# EAGLE design LED_MatrixA (EAGLE 5.02)
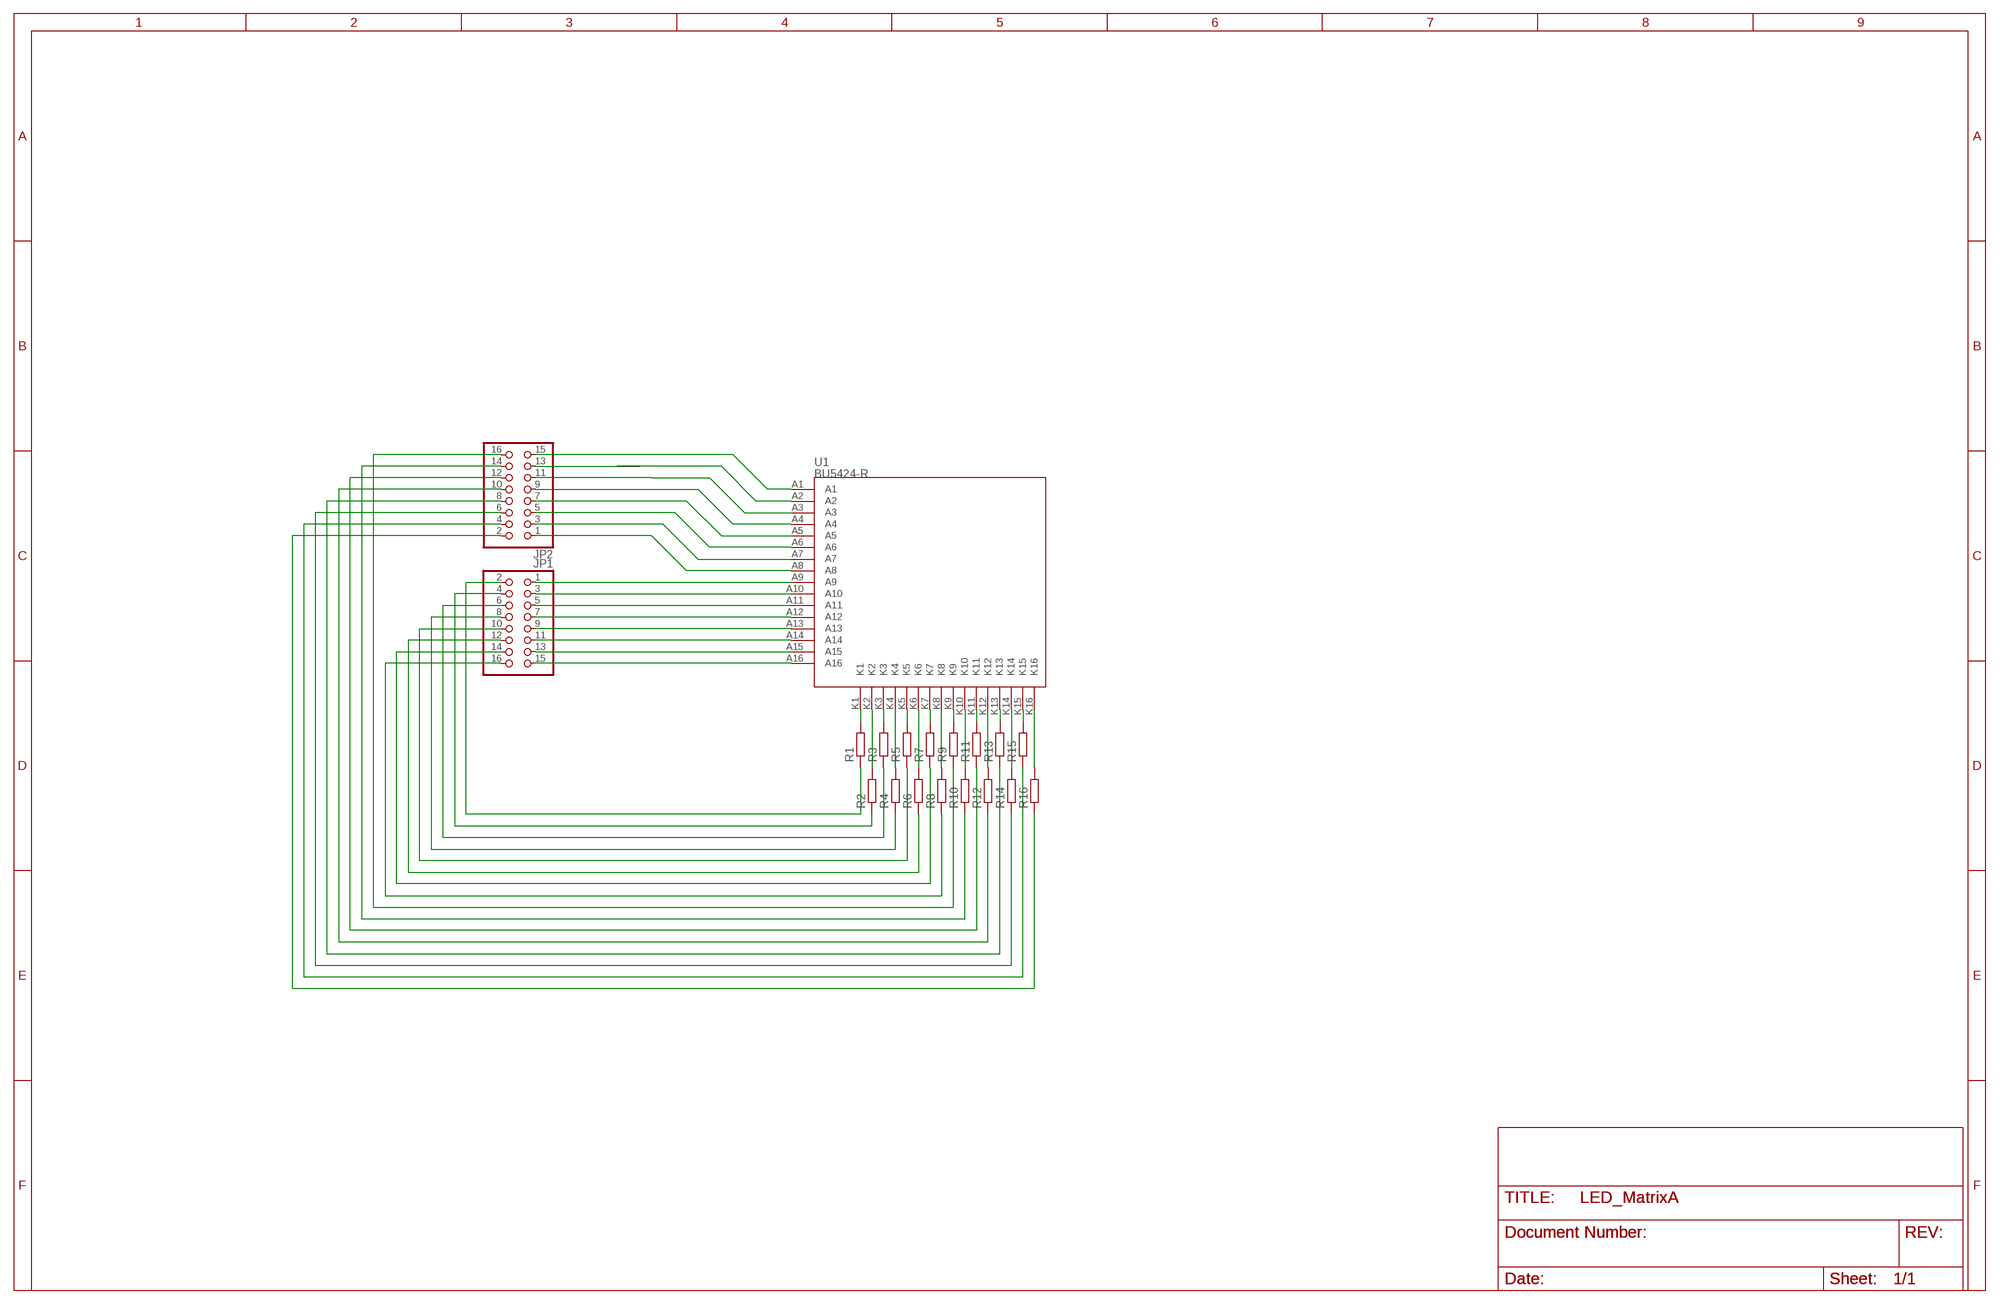
[diagram p0: schematic, sheet 1]

## Parts
JP1  PINHD-2X8  [2X08]
JP2  PINHD-2X8  [2X08]
R1  R-EU_R0805  [R0805]
R2  R-EU_R0805  [R0805]
R3  R-EU_R0805  [R0805]
R4  R-EU_R0805  [R0805]
R5  R-EU_R0805  [R0805]
R6  R-EU_R0805  [R0805]
R7  R-EU_R0805  [R0805]
R8  R-EU_R0805  [R0805]
R9  R-EU_R0805  [R0805]
R10  R-EU_R0805  [R0805]
R11  R-EU_R0805  [R0805]
R12  R-EU_R0805  [R0805]
R13  R-EU_R0805  [R0805]
R14  R-EU_R0805  [R0805]
R15  R-EU_R0805  [R0805]
R16  R-EU_R0805  [R0805]
U1  BU5424-R  [BU5424]

## Nets
N$1: JP1.4 R2.1
N$3: JP2.9 U1.A4
N$5: JP2.5 U1.A6
N$6: JP2.1 U1.A8
N$7: JP2.3 U1.A7
N$9: JP1.1 U1.A9
N$10: JP1.3 U1.A10
N$11: JP1.5 U1.A11
N$12: JP1.7 U1.A12
N$13: JP1.9 U1.A13
N$14: JP1.11 U1.A14
N$15: JP1.13 U1.A15
N$16: JP1.15 U1.A16
N$17: R1.2 U1.K1
N$18: R3.2 U1.K3
N$19: R5.2 U1.K5
N$20: R7.2 U1.K7
N$21: R9.2 U1.K9
N$22: R11.2 U1.K11
N$23: R13.2 U1.K13
N$24: R15.2 U1.K15
N$25: R16.2 U1.K16
N$26: R14.2 U1.K14
N$27: R12.2 U1.K12
N$28: R10.2 U1.K10
N$29: R8.2 U1.K8
N$30: R6.2 U1.K6
N$31: R4.2 U1.K4
N$32: R2.2 U1.K2
N$54: JP2.2 R16.1
N$55: JP2.4 R15.1
N$56: JP2.6 R14.1
N$57: JP2.8 R13.1
N$58: JP2.10 R12.1
N$59: JP2.12 R11.1
N$60: JP2.14 R10.1
N$61: JP2.16 R9.1
N$62: JP1.16 R8.1
N$63: JP2.7 U1.A5
N$64: JP1.14 R7.1
N$65: JP1.12 R6.1
N$66: JP1.10 R5.1
N$67: JP1.8 R4.1
N$68: JP1.6 R3.1
N$70: JP1.2 R1.1
N$72: JP2.11 U1.A3
N$73: JP2.13 U1.A2
N$74: JP2.15 U1.A1

## Library data of the parts
JP1 JP2 = pinhead:PINHD-2X8: PIN HEADER
R1-R16 = rcl:R-EU_: RESISTOR, European symbol
U1 = LEDMATRIX:BU5424-R

## Board
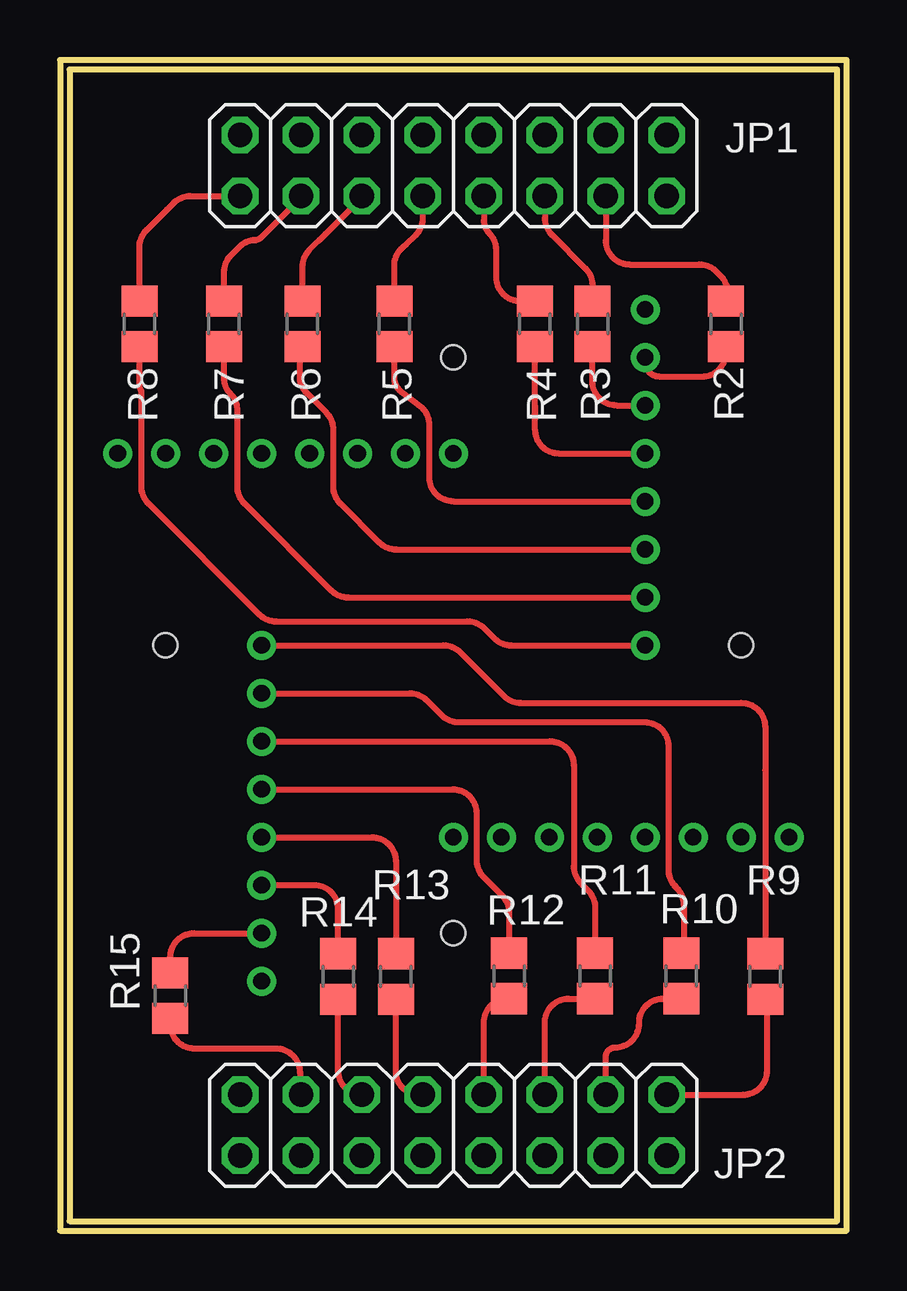
[diagram p1: board, top side]
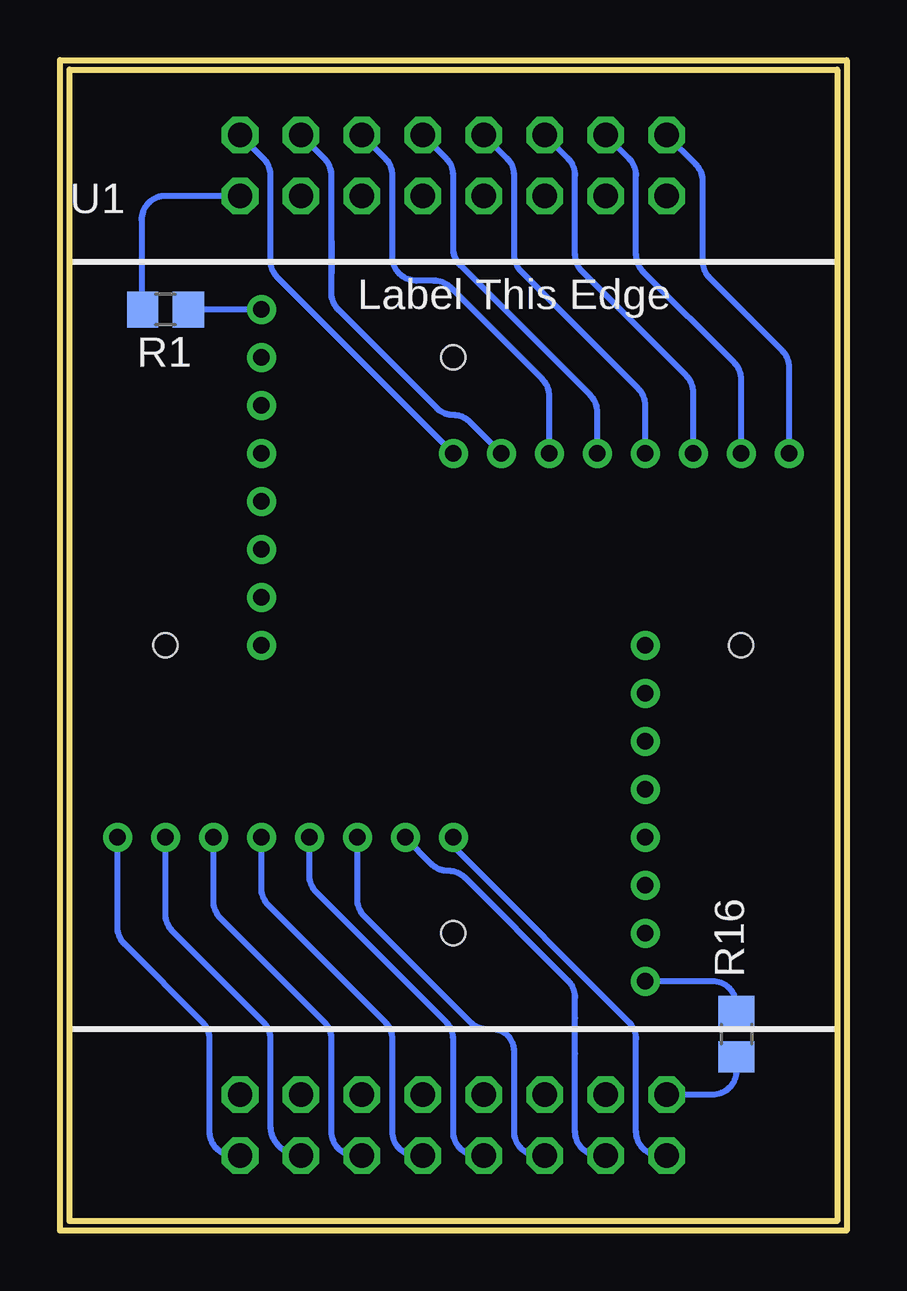
[diagram p2: board, bottom side, seen from below]

Size 32.8 x 48.8 mm. Coordinates in mm from the lower left corner, seen from the top.
Outline: 0,0 32.8,0 32.8,48.8 0,48.8 0,0
Outline: 0.4,0.4 32.4,0.4 32.4,48.4 0.4,48.4 0.4,0.4
Copper layers (1*16): Top 0.035mm / dielectric 1.5mm / Bottom 0.035mm
Design rules "olimex-8mils": minimum track width 8mil, minimum drill 0.6mm, track to track 8mil, track to pad 8mil, pad to pad 8mil, via to via 8mil, smd to smd 8mil, copper to edge 40mil, drill to drill 10mil, minimum pad ring 10mil, minimum via ring 8mil, stop-mask expansion 0mil, vias tented up to drill 0mil, thermal gap 10mil

### Footprints (pad centres in the part's own frame; a part is rotated, then mirrored left to right if it is on the bottom)
2X08 = drill 1.016 octagon: 1 -8.89,-1.27; 2 -8.89,1.27; 3 -6.35,-1.27; 4 -6.35,1.27; 5 -3.81,-1.27; 6 -3.81,1.27; 7 -1.27,-1.27; 8 -1.27,1.27; 9 1.27,-1.27; 10 1.27,1.27; 11 3.81,-1.27; 12 3.81,1.27; 13 6.35,-1.27; 14 6.35,1.27; 15 8.89,-1.27; 16 8.89,1.27
R0805 = smd 1.3 x 1.5: 1 -0.95,0; 2 0.95,0
BU5424 = drill 0.7 round: A1 -14,-8; A2 -12,-8; A3 -10,-8; A4 -8,-8; A5 -6,-8; A6 -4,-8; A7 -2,-8; A8 0,-8; A9 0,8; A10 2,8; A11 4,8; A12 6,8; A13 8,8; A14 10,8; A15 12,8; A16 14,8; K1 -8,14; K2 -8,12; K3 -8,10; K4 -8,8; K5 -8,6; K6 -8,4; K7 -8,2; K8 -8,0; K9 8,0; K10 8,-2; K11 8,-4; K12 8,-6; K13 8,-8; K14 8,-10; K15 8,-12; K16 8,-14 | hole 1: 12,0; -12,0; 0,12; 0,-12

### Placement (x,y rotation side)
JP1  16.4,44.4 180 top
JP2  16.4,4.4 0 top
R1  28.4,38.4 0 bottom
R2  27.76,37.8 270 top
R3  22.2,37.8 270 top
R4  19.8,37.8 270 top
R5  13.94,37.8 270 top
R6  10.11,37.8 270 top
R7  6.84,37.8 270 top
R8  3.32,37.8 270 top
R9  29.4,10.6 90 top
R10  25.9,10.62 90 top
R11  22.31,10.62 90 top
R12  18.72,10.62 90 top
R13  14,10.6 90 top
R14  11.6,10.6 90 top
R15  4.6,9.8 90 top
R16  4.6,8.2 90 bottom
U1  16.4,24.4 0 bottom

### Tracks (layer width: path | path; a pad name or v marks a point on that pad's centre or on a via)
N$1
  Top 0.254: JP1.4 22.75,41.28 arc90 23.75,40.28 26.66,40.28 arc-45 27.36,39.98 27.54,39.81 arc-45 27.83,39.1 27.83,38.5 27.76,38.57 R2.1
N$3
  Bottom 0.254: JP2.9 17.94,3.13 arc90 18.94,4.13 18.94,7.99 arc-45 19.23,8.69 24.11,13.57 arc45 24.4,14.27 U1.A4
N$5
  Bottom 0.254: JP2.5 12.86,3.13 arc90 13.86,4.13 13.86,7.49 arc-90 14.78,8.4 14.99,8.4 arc45 15.69,8.69 20.11,13.11 arc45 20.4,13.81 U1.A6
N$6
  Bottom 0.254: JP2.1 7.78,3.13 arc90 8.78,4.13 8.78,7.99 arc-45 9.08,8.69 16.13,15.75 arc45 U1.A8
N$7
  Bottom 0.254: JP2.3 10.32,3.13 arc90 11.32,4.13 11.32,7.39 | 11.32,7.39 11.32,8.86 | U1.A7 arc-45 18.38,16.34 17.32,15.29 arc-45 16.62,15 16.6,15 arc45 15.92,14.72 11.62,10.42 arc45 11.32,9.71 11.32,7.39
N$9
  Bottom 0.254: JP1.1 24.31,44.7 arc45 24.02,43.99 24.02,40.44 arc-45 23.73,39.73 U1.A9
N$10
  Bottom 0.254: JP1.3 JP1.3 arc45 JP1.3 21.77,44.69 arc45 21.48,43.98 21.48,41.27 | 21.48,41.27 21.48,39.9 | U1.A10 15.72,33.72 arc-45 16.4,34 arc45 17.08,34.28 21.19,38.39 arc45 21.48,39.1 21.48,41.27
N$11
  Bottom 0.254: JP1.5 19.23,44.7 arc45 18.94,43.99 18.94,40.6 arc-90 17.94,39.6 17.21,39.6 arc45 16.51,39.31 12.69,35.49 arc45 12.4,34.79 12.4,32.6 | 12.4,32.6 12.4,33.39 | U1.A11 12.4,32.6
N$12
  Bottom 0.254: U1.A12 10.4,34.12 arc-45 10.69,34.82 16.11,40.24 arc45 16.4,40.95 16.4,43.99 arc-45 16.7,44.7 JP1.7
N$13
  Bottom 0.254: U1.A13 8.4,34.4 arc-45 8.69,35.11 13.57,39.98 arc45 13.86,40.69 13.86,43.99 arc-45 14.16,44.7 JP1.9
N$14
  Bottom 0.254: U1.A14 6.4,34.94 arc-45 6.69,35.65 11.03,39.98 arc45 11.32,40.69 11.32,43.99 arc-45 11.62,44.7 JP1.11
N$15
  Bottom 0.254: U1.A15 4.4,35.48 arc-45 4.69,36.19 8.49,39.98 arc45 8.78,40.69 8.78,43.99 arc-45 9.08,44.7 JP1.13
N$16
  Bottom 0.254: JP1.15 6.29,44.45 arc45 6,43.75 6,40.41 arc-45 5.71,39.71 2.69,36.69 arc45 2.4,35.99 U1.A16
N$17
  Bottom 0.254: R1.2 27.42,38.6 27.22,38.4 U1.K1
N$18
  Top 0.254: R3.2 22.2,35.4 arc90 23.2,34.4 U1.K3
N$19
  Top 0.254: R5.2 13.94,35.47 arc45 14.24,34.96 15.11,34.29 arc-45 15.4,33.59 15.4,31.4 arc90 16.4,30.4 U1.K5
N$20
  Top 0.254: U1.K7 12.01,26.4 arc-45 11.31,26.69 7.69,30.31 arc-45 7.4,31.01 7.4,34.19 arc45 7.11,34.89 arc-45 6.84,35.53 R7.2
N$21
  Top 0.254: R9.2 29.4,19.2 29.4,21 arc90 28.4,22 19.21,22 arc-45 18.51,22.29 16.69,24.11 arc45 15.99,24.4 U1.K9
N$22
  Top 0.254: U1.K11 20.42,20.4 arc-90 21.42,19.4 21.42,15.2 arc45 21.71,14.49 21.8,14.4 22.02,14.18 arc-45 22.31,13.48 R11.2
N$23
  Top 0.254: U1.K13 13,16.4 arc-90 14,15.4 R13.2
N$24
  Top 0.254: U1.K15 5.6,12.4 arc90 4.6,11.4 R15.2
N$25
  Bottom 0.254: U1.K16 5.6,10.4 arc90 4.6,9.4 R16.2
N$26
  Top 0.254: 11.6,11.4 R14.2 11.6,13.4 arc90 10.6,14.4 U1.K14
N$27
  Top 0.254: U1.K12 16.37,18.4 arc-90 17.37,17.4 17.37,15.45 arc45 17.66,14.74 18,14.4 18.43,13.97 arc-45 18.72,13.26 R12.2
N$28
  Top 0.254: 24.37,21.2 arc-90 25.37,20.2 25.37,15.05 arc45 25.66,14.34 arc90 25.6,14.4 25.71,14.29 arc-45 26,13.59 26,11.6 25.9,11.6 R10.2 26,11.57 | U1.K10 14.59,22.4 arc-45 15.29,22.11 15.91,21.49 arc45 16.61,21.2 24.37,21.2 | 24.37,21.2 24.4,21.2
N$29
  Top 0.254: R8.2 3.32,35.2 arc45 3.4,35 3.4,31.01 arc45 3.69,30.31 8.31,25.69 arc45 9.01,25.4 16.99,25.4 arc-45 17.69,25.11 18.11,24.69 arc45 18.81,24.4 U1.K8
N$30
  Top 0.254: R6.2 10.11,36.8 10,36.6 10,35.61 arc45 10.29,34.91 11.11,34.09 arc-45 11.4,33.39 11.4,31.01 arc45 11.69,30.31 13.31,28.69 arc45 14.01,28.4 U1.K6
N$31
  Top 0.254: 19.8,34.4 19.8,33.81 | 19.8,34.4 R4.2 | U1.K4 20.8,32.4 arc-90 19.8,33.4 19.8,34.4
N$32
  Top 0.254: R2.2 27.76,36.6 arc-90 26.76,35.6 25,35.6 arc-90 24.4,36.2 U1.K2
N$54
  Bottom 0.254: JP2.2 5.6,5.67 arc-90 4.6,6.67 R16.1
N$55
  Top 0.254: R15.1 4.6,8.6 arc90 5.6,7.6 9,7.6 arc-90 10,6.6 10,5.62 | 10,5.62 10,5.6 | 10,5.62 arc-90 JP2.4
N$56
  Top 0.254: JP2.6 JP2.6 arc-90 11.6,6.66 R14.1 11.59,9.67
N$57
  Top 0.254: JP2.8 arc-90 15.12,5.66 15.11,5.66 arc-90 14,6.56 R13.1
N$58
  Top 0.254: JP2.10 17.67,8.67 arc-90 18.67,9.67 R12.1
N$59
  Top 0.254: JP2.12 20.21,5.61 | JP2.12 | JP2.12 20.21,8.67 arc-90 21.21,9.67 R11.1
N$60
  Top 0.254: R10.1 25.15,9.67 arc90 24.15,8.67 24.15,8.64 arc-90 23.15,7.64 arc90 22.75,7.24 JP2.14
N$61
  Top 0.254: 29.48,9.65 29.48,9.93 | 29.48,9.65 R9.1 | JP2.16 28.48,5.67 arc90 29.48,6.67 29.48,9.65
N$62
  Top 0.254: 4.46,42.56 4.21,42.31 | 4.46,42.56 4.74,42.84 arc-45 5.44,43.13 JP1.16 | R8.1 3.32,41 arc-45 3.61,41.71 4.46,42.56
N$63
  Bottom 0.254: JP2.7 15.4,3.13 arc90 16.4,4.13 16.4,7.99 arc-45 16.7,8.69 22.11,14.11 arc45 22.4,14.81 U1.A5
N$64
  Top 0.254: JP1.14 10.05,43.07 8.38,41.4 arc-45 8.12,41.29 arc45 7.51,41.04 | 7.51,41.04 7,40.53 | R7.1 6.84,39.96 arc-45 7.14,40.66 7.51,41.04
N$65
  Top 0.254: JP1.12 12.59,43.07 11.07,41.55 | 11.07,41.55 10.81,41.29 | R6.1 10.11,40.18 arc-45 10.41,40.88 11.07,41.55
N$66
  Top 0.254: R5.1 13.94,40.4 arc-45 14.44,41.11 14.84,41.51 arc45 15.13,42.21 JP1.10
N$67
  Top 0.254: R4.1 19.18,38.75 arc-90 18.18,39.75 18.18,40.88 arc45 17.89,41.59 arc-45 17.67,42.11 JP1.8
N$68
  Top 0.254: JP1.6 20.21,42.22 arc45 20.5,41.51 21.91,40.11 arc-45 22.2,39.4 R3.1
N$70
  Bottom 0.254: R1.1 29.4,38.4 29.4,42.13 arc90 28.4,43.13 JP1.2
N$72
  Bottom 0.254: JP2.11 20.48,3.13 arc90 21.48,4.13 21.48,7.99 arc-45 21.77,8.69 26.11,13.03 arc45 26.4,13.73 U1.A3
N$73
  Bottom 0.254: JP2.13 arc90 24.02,4.4 24.02,7.99 arc-45 24.31,8.69 28.11,12.49 arc45 28.4,13.19 U1.A2
N$74
  Bottom 0.254: JP2.15 25.56,3.13 arc90 26.56,4.13 26.56,7.99 arc-45 26.85,8.69 30.11,11.95 arc45 30.4,12.65 U1.A1